# Altium project AT91SAM.PrjPcb
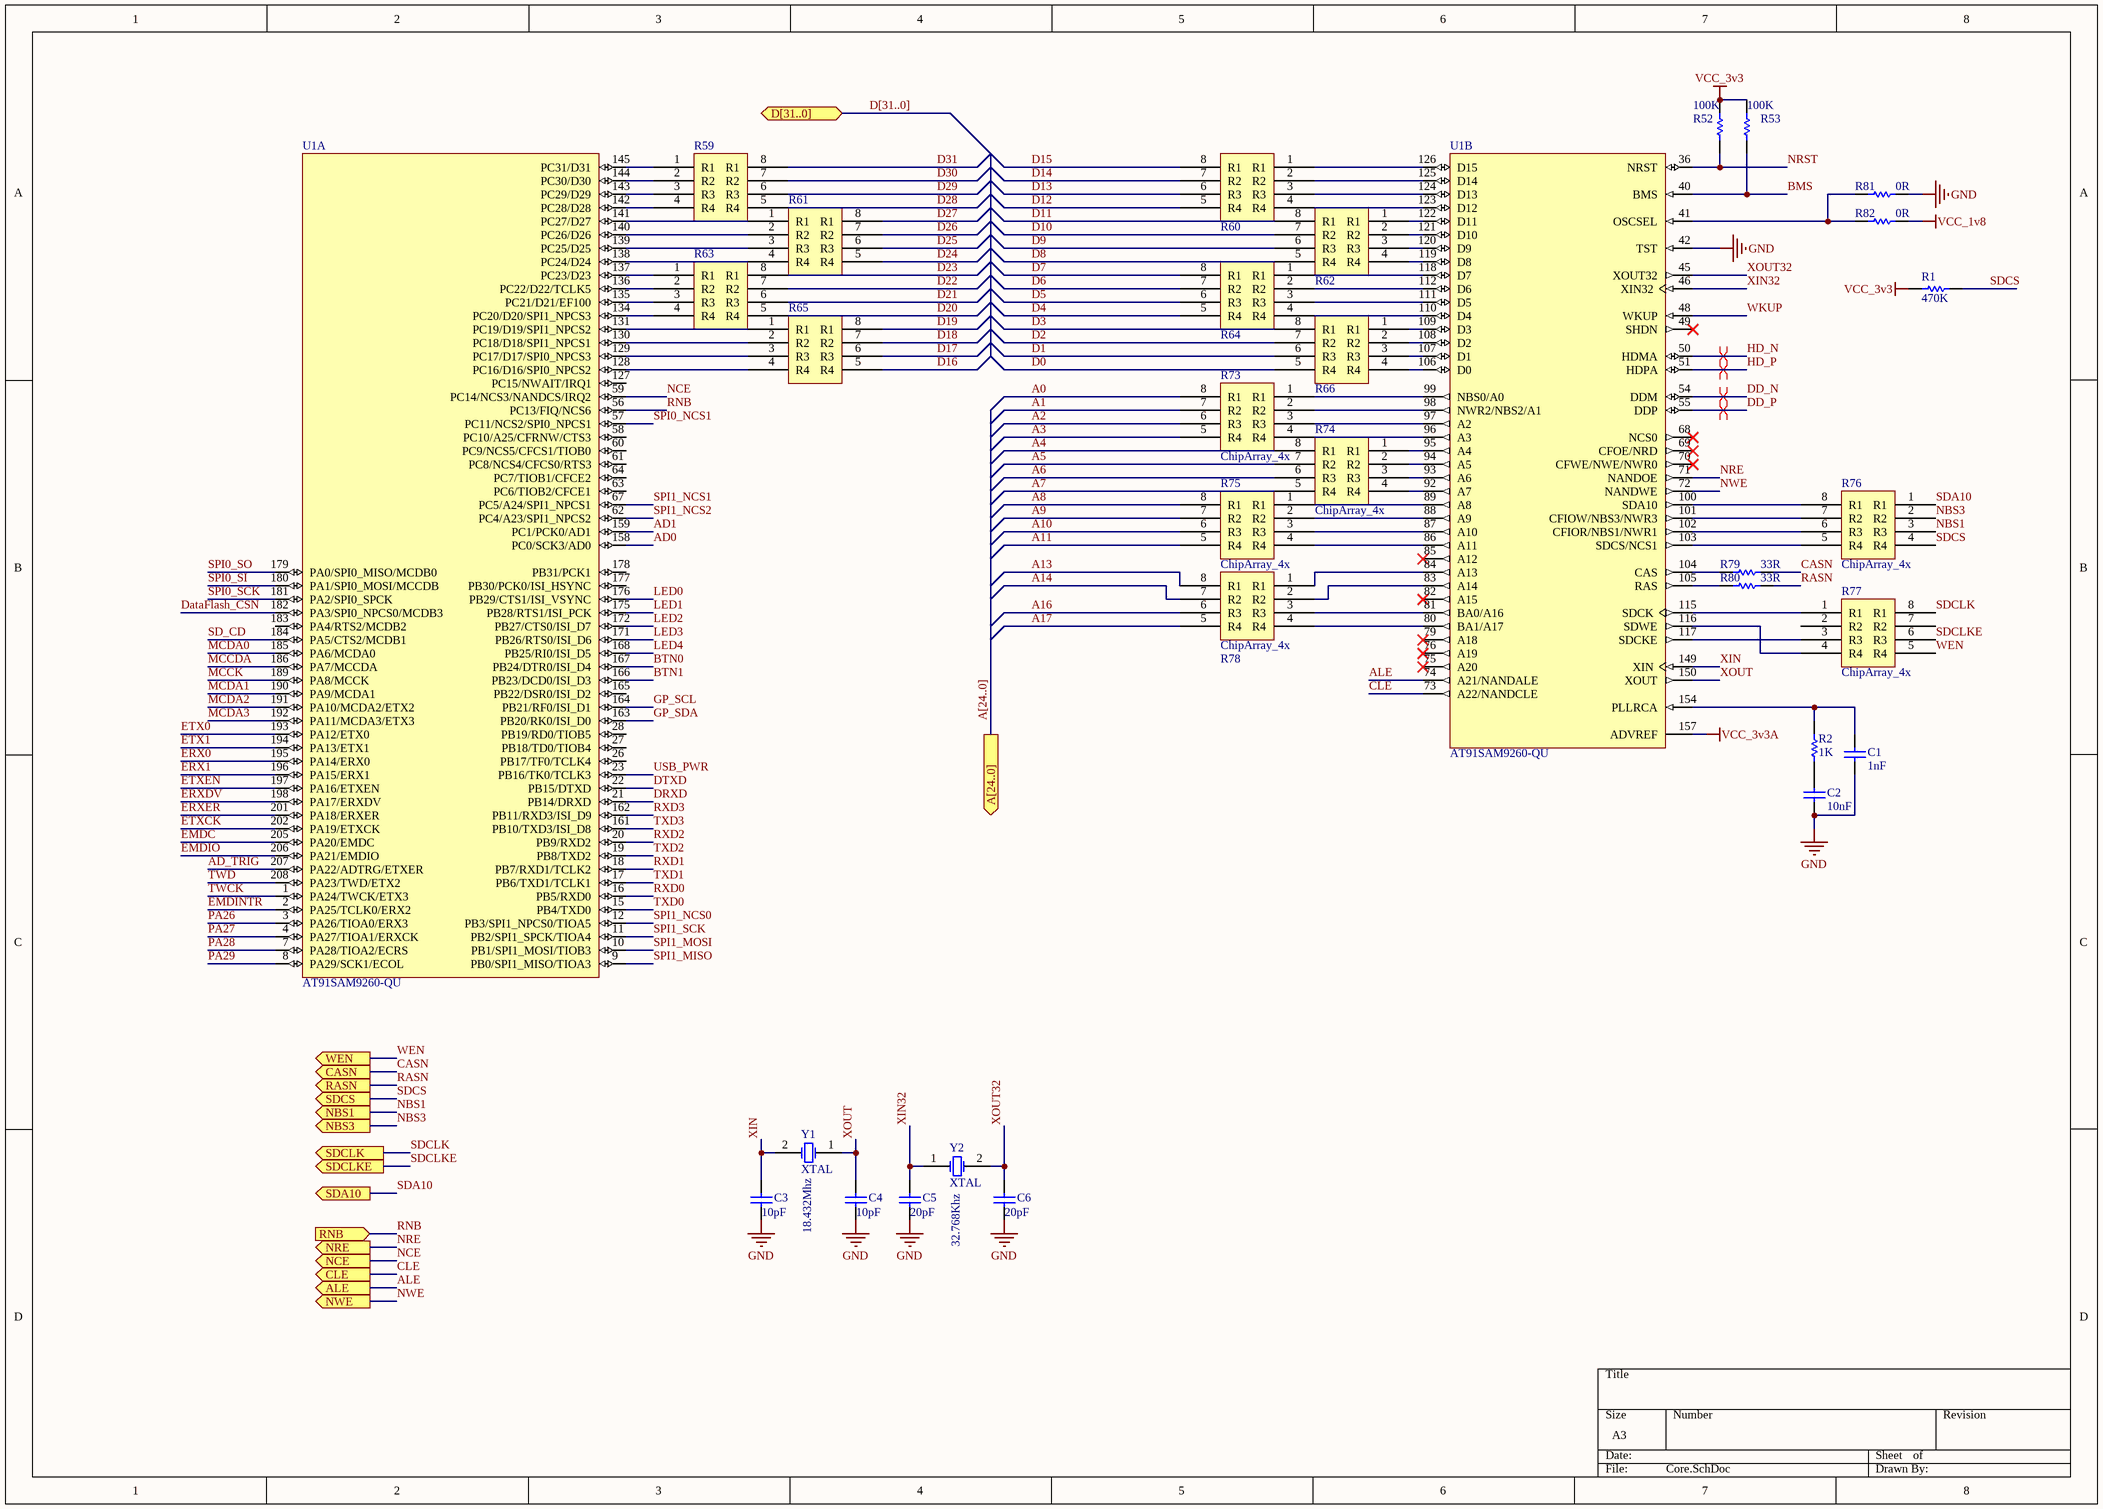
[diagram p0: Core.SchDoc]
6 sheets, 226 parts. Net scope: global (net labels, ports and power ports of the same name join across sheets).
Board file: AT91-PCB.PcbDoc
Sheets:
  Core.SchDoc
  Network.SchDoc
  Power.SchDoc
  Peripheral.SchDoc
  Memory.SchDoc
  Connector.SchDoc

## Sheet Core.SchDoc
size A3

### Parts
C1  value 1nF  [C0805]  (hidden comment: Cap)
C2  value 10nF  [C0805]  (hidden comment: Cap)
C3  value 10pF  [C0805]  (hidden comment: Cap)
C4  value 10pF  [C0805]  (hidden comment: Cap)
C5  value 20pF  [0603PKG]  (hidden comment: Cap)
C6  value 20pF  [0603PKG]  (hidden comment: Cap)
R1  value 470K  [C0805]  (hidden comment: Res Semi)
R2  value 1K  [C0805]  (hidden comment: Res Semi)
R52  value 100K  [C0805]  (hidden comment: Res1)
R53  value 100K  [C0805]  (hidden comment: Res1)
R59  ChipArray_4x  [CAC-50P205X105-8M]  (value not drawn)
R60  ChipArray_4x  [CAC-50P205X105-8M]  (value not drawn)
R61  ChipArray_4x  [CAC-50P205X105-8M]  (value not drawn)
R62  ChipArray_4x  [CAC-50P205X105-8M]  (value not drawn)
R63  ChipArray_4x  [CAC-50P205X105-8M]  (value not drawn)
R64  ChipArray_4x  [CAC-50P205X105-8M]  (value not drawn)
R65  ChipArray_4x  [CAC-50P205X105-8M]  (value not drawn)
R66  ChipArray_4x  [CAC-50P205X105-8M]  (value not drawn)
R73  ChipArray_4x  [CAC-50P205X105-8M]
R74  ChipArray_4x  [CAC-50P205X105-8M]
R75  ChipArray_4x  [CAC-50P205X105-8M]
R76  ChipArray_4x  [CAC-50P205X105-8M]
R77  ChipArray_4x  [CAC-50P205X105-8M]
R78  ChipArray_4x  [CAC-50P205X105-8M]
R79  value 33R  [C0805]  (hidden comment: Res Semi)
R80  value 33R  [C0805]  (hidden comment: Res Semi)
R81  value 0R  [0603PKG]  (hidden comment: Res Semi)
R82  value 0R  [0603PKG]  (hidden comment: Res Semi)
U1  AT91SAM9260-QU  [SQFP50P3122X3122X245-208N]  (parts A,B of 4)
Y1  XTAL  value 18.432Mhz  [SMD_Crystal]
Y2  XTAL  value 32.768Khz  [R38]

### Ports
A[24..0] (out), ALE (out), CASN (out), CLE (out), D[31..0], NBS1 (out), NBS3 (out), NCE (out), NRE (out), NWE (out), RASN (out), RNB (in), SDA10 (out), SDCLK (out), SDCLKE (out), SDCS (out), WEN (out)

### Nets
GND: C1.2 C2.1 C3.1 C4.1 C5.1 C6.1 R81.2 U1.42(TST)
VCC_1v8: R82.2
VCC_3v3: R1.1 R52.2 R53.2
VCC_3v3A: U1.157(ADVREF)
A0: R73.8(R1)
A1: R73.7(R2)
A2: R73.6(R3)
A3: R73.5(R4)
A4: R74.8(R1)
A5: R74.7(R2)
A6: R74.6(R3)
A7: R74.5(R4)
A8: R75.8(R1)
A9: R75.7(R2)
A10: R75.6(R3)
A11: R75.5(R4)
A13: R78.8(R1)
A14: R78.7(R2)
A16: R78.6(R3)
A17: R78.5(R4)
AD0: U1.158(PC0/SCK3/AD0)
AD1: U1.159(PC1/PCK0/AD1)
AD_TRIG: U1.207(PA22/ADTRG/ETXER)
ALE: U1.74(A21/NANDALE) ; port ALE
BMS: R53.1 U1.40(BMS)
BTN0: U1.167(PB24/DTR0/ISI_D4)
BTN1: U1.166(PB23/DCD0/ISI_D3)
CASN: R79.2 ; port CASN
CLE: U1.73(A22/NANDCLE) ; port CLE
D0: R66.5(R4)
D1: R66.6(R3)
D2: R66.7(R2)
D3: R66.8(R1)
D4: R64.5(R4)
D5: R64.6(R3)
D6: R64.7(R2)
D7: R64.8(R1)
D8: R62.5(R4)
D9: R62.6(R3)
D10: R62.7(R2)
D11: R62.8(R1)
D12: R60.5(R4)
D13: R60.6(R3)
D14: R60.7(R2)
D15: R60.8(R1)
D16: R65.5(R4)
D17: R65.6(R3)
D18: R65.7(R2)
D19: R65.8(R1)
D20: R63.5(R4)
D21: R63.6(R3)
D22: R63.7(R2)
D23: R63.8(R1)
D24: R61.5(R4)
D25: R61.6(R3)
D26: R61.7(R2)
D27: R61.8(R1)
D28: R59.5(R4)
D29: R59.6(R3)
D30: R59.7(R2)
D31: R59.8(R1)
DataFlash_CSN: U1.182(PA3/SPI0_NPCS0/MCDB3)
DD_N: U1.54(DDM)
DD_P: U1.55(DDP)
DRXD: U1.21(PB14/DRXD)
DTXD: U1.22(PB15/DTXD)
EMDC: U1.205(PA20/EMDC)
EMDINTR: U1.2(PA25/TCLK0/ERX2)
EMDIO: U1.206(PA21/EMDIO)
ERX0: U1.195(PA14/ERX0)
ERX1: U1.196(PA15/ERX1)
ERXDV: U1.198(PA17/ERXDV)
ERXER: U1.201(PA18/ERXER)
ETX0: U1.193(PA12/ETX0)
ETX1: U1.194(PA13/ETX1)
ETXCK: U1.202(PA19/ETXCK)
ETXEN: U1.197(PA16/ETXEN)
GP_SCL: U1.164(PB21/RF0/ISI_D1)
GP_SDA: U1.163(PB20/RK0/ISI_D0)
HD_N: U1.50(HDMA)
HD_P: U1.51(HDPA)
LED0: U1.176(PB29/CTS1/ISI_VSYNC)
LED1: U1.175(PB28/RTS1/ISI_PCK)
LED2: U1.172(PB27/CTS0/ISI_D7)
LED3: U1.171(PB26/RTS0/ISI_D6)
LED4: U1.168(PB25/RI0/ISI_D5)
MCCDA: U1.186(PA7/MCCDA)
MCCK: U1.189(PA8/MCCK)
MCDA0: U1.185(PA6/MCDA0)
MCDA1: U1.190(PA9/MCDA1)
MCDA2: U1.191(PA10/MCDA2/ETX2)
MCDA3: U1.192(PA11/MCDA3/ETX3)
NBS1: R76.3(R3) ; port NBS1
NBS3: R76.2(R2) ; port NBS3
NCE: U1.59(PC14/NCS3/NANDCS/IRQ2) ; port NCE
NRE: U1.71(NANDOE) ; port NRE
NRST: R52.1 U1.36(NRST)
NWE: U1.72(NANDWE) ; port NWE
PA26: U1.3(PA26/TIOA0/ERX3)
PA27: U1.4(PA27/TIOA1/ERXCK)
PA28: U1.7(PA28/TIOA2/ECRS)
PA29: U1.8(PA29/SCK1/ECOL)
RASN: R80.2 ; port RASN
RNB: U1.56(PC13/FIQ/NCS6) ; port RNB
RXD0: U1.16(PB5/RXD0)
RXD1: U1.18(PB7/RXD1/TCLK2)
RXD2: U1.20(PB9/RXD2)
RXD3: U1.162(PB11/RXD3/ISI_D9)
SD_CD: U1.184(PA5/CTS2/MCDB1)
SDA10: R76.1(R1) ; port SDA10
SDCLK: R77.8(R1) ; port SDCLK
SDCLKE: R77.6(R3) ; port SDCLKE
SDCS: R1.2 R76.4(R4) ; port SDCS
SPI0_NCS1: U1.57(PC11/NCS2/SPI0_NPCS1)
SPI0_SCK: U1.181(PA2/SPI0_SPCK)
SPI0_SI: U1.180(PA1/SPI0_MOSI/MCCDB)
SPI0_SO: U1.179(PA0/SPI0_MISO/MCDB0)
SPI1_MISO: U1.9(PB0/SPI1_MISO/TIOA3)
SPI1_MOSI: U1.10(PB1/SPI1_MOSI/TIOB3)
SPI1_NCS0: U1.12(PB3/SPI1_NPCS0/TIOA5)
SPI1_NCS1: U1.67(PC5/A24/SPI1_NPCS1)
SPI1_NCS2: U1.62(PC4/A23/SPI1_NPCS2)
SPI1_SCK: U1.11(PB2/SPI1_SPCK/TIOA4)
TWCK: U1.1(PA24/TWCK/ETX3)
TWD: U1.208(PA23/TWD/ETX2)
TXD0: U1.15(PB4/TXD0)
TXD1: U1.17(PB6/TXD1/TCLK1)
TXD2: U1.19(PB8/TXD2)
TXD3: U1.161(PB10/TXD3/ISI_D8)
USB_PWR: U1.23(PB16/TK0/TCLK3)
WEN: R77.5(R4) ; port WEN
WKUP: U1.48(WKUP)
XIN: C3.2 U1.149(XIN) Y1.2(OSC2)
XIN32: C5.2 U1.46(XIN32) Y2.1(OSC1)
XOUT: C4.2 U1.150(XOUT) Y1.1(OSC1)
XOUT32: C6.2 U1.45(XOUT32) Y2.2(OSC2)
NetC1_1: C1.1 R2.2 U1.154(PLLRCA)
NetC2_2: C2.2 R2.1
NetR59_1: R59.1(R1) U1.145(PC31/D31)
NetR59_2: R59.2(R2) U1.144(PC30/D30)
NetR59_3: R59.3(R3) U1.143(PC29/D29)
NetR59_4: R59.4(R4) U1.142(PC28/D28)
NetR60_1: R60.1(R1) U1.126(D15)
NetR60_2: R60.2(R2) U1.125(D14)
NetR60_3: R60.3(R3) U1.124(D13)
NetR60_4: R60.4(R4) U1.123(D12)
NetR61_1: R61.1(R1) U1.141(PC27/D27)
NetR61_2: R61.2(R2) U1.140(PC26/D26)
NetR61_3: R61.3(R3) U1.139(PC25/D25)
NetR61_4: R61.4(R4) U1.138(PC24/D24)
NetR62_1: R62.1(R1) U1.122(D11)
NetR62_2: R62.2(R2) U1.121(D10)
NetR62_3: R62.3(R3) U1.120(D9)
NetR62_4: R62.4(R4) U1.119(D8)
NetR63_1: R63.1(R1) U1.137(PC23/D23)
NetR63_2: R63.2(R2) U1.136(PC22/D22/TCLK5)
NetR63_3: R63.3(R3) U1.135(PC21/D21/EF100)
NetR63_4: R63.4(R4) U1.134(PC20/D20/SPI1_NPCS3)
NetR64_1: R64.1(R1) U1.118(D7)
NetR64_2: R64.2(R2) U1.112(D6)
NetR64_3: R64.3(R3) U1.111(D5)
NetR64_4: R64.4(R4) U1.110(D4)
NetR65_1: R65.1(R1) U1.131(PC19/D19/SPI1_NPCS2)
NetR65_2: R65.2(R2) U1.130(PC18/D18/SPI1_NPCS1)
NetR65_3: R65.3(R3) U1.129(PC17/D17/SPI0_NPCS3)
NetR65_4: R65.4(R4) U1.128(PC16/D16/SPI0_NPCS2)
NetR66_1: R66.1(R1) U1.109(D3)
NetR66_2: R66.2(R2) U1.108(D2)
NetR66_3: R66.3(R3) U1.107(D1)
NetR66_4: R66.4(R4) U1.106(D0)
NetR73_1: R73.1(R1) U1.99(NBS0/A0)
NetR73_2: R73.2(R2) U1.98(NWR2/NBS2/A1)
NetR73_3: R73.3(R3) U1.97(A2)
NetR73_4: R73.4(R4) U1.96(A3)
NetR74_1: R74.1(R1) U1.95(A4)
NetR74_2: R74.2(R2) U1.94(A5)
NetR74_3: R74.3(R3) U1.93(A6)
NetR74_4: R74.4(R4) U1.92(A7)
NetR75_1: R75.1(R1) U1.89(A8)
NetR75_2: R75.2(R2) U1.88(A9)
NetR75_3: R75.3(R3) U1.87(A10)
NetR75_4: R75.4(R4) U1.86(A11)
NetR76_5: R76.5(R4) U1.103(SDCS/NCS1)
NetR76_6: R76.6(R3) U1.102(CFIOR/NBS1/NWR1)
NetR76_7: R76.7(R2) U1.101(CFIOW/NBS3/NWR3)
NetR76_8: R76.8(R1) U1.100(SDA10)
NetR77_1: R77.1(R1) U1.115(SDCK)
NetR77_3: R77.3(R3) U1.117(SDCKE)
NetR77_4: R77.4(R4) U1.116(SDWE)
NetR78_1: R78.1(R1) U1.84(A13)
NetR78_2: R78.2(R2) U1.83(A14)
NetR78_3: R78.3(R3) U1.81(BA0/A16)
NetR78_4: R78.4(R4) U1.80(BA1/A17)
NetR79_1: R79.1 U1.104(CAS)
NetR80_1: R80.1 U1.105(RAS)
NetR81_1: R81.1 R82.1 U1.41(OSCSEL)

Not connected (* = marked no-connect by the designer): R77 2(R2) 7(R2); U1 26(PB17/TF0/TCLK4) 27(PB18/TD0/TIOB4) 28(PB19/RD0/TIOB5) 49(SHDN)* 58(PC10/A25/CFRNW/CTS3) 60(PC9/NCS5/CFCS1/TIOB0) 61(PC8/NCS4/CFCS0/RTS3) 63(PC6/TIOB2/CFCE1) 64(PC7/TIOB1/CFCE2) 68(NCS0)* 69(CFOE/NRD)* 70(CFWE/NWE/NWR0)* 75(A20)* 76(A19)* 79(A18)* 82(A15)* 85(A12)* 127(PC15/NWAIT/IRQ1) 165(PB22/DSR0/ISI_D2) 177(PB30/PCK0/ISI_HSYNC) 178(PB31/PCK1) 183(PA4/RTS2/MCDB2)

### Buses and harness runs
bus A[24..0] = port A[24..0]
bus D[31..0] = port D[31..0]

### Layout directives
differential pair: DD_N, DD_P, HD_N, HD_P

### Library data of the parts
C1-C6 = Cap: Capacitor; Published: 8-Jun-2000; LatestRevisionDate: 17-Jul-2002; LatestRevisionNote: Re-released for DXP Platform.; PackageReference: RAD-0.3; Publisher: Altium Limited; PackageDescription: Radial Cap, Thru-Hole; 2 Leads; 0.3 in Pin Spacing
R1 R2 R79-R82 = Res Semi: Semiconductor Resistor; Published: 8-Jun-2000; LatestRevisionDate: 17-Jul-2002; LatestRevisionNote: Re-released for DXP Platform.; PackageReference: AXIAL-0.5; Publisher: Altium Limited; PackageDescription: Axial Device, Thru-Hole; 2 Leads; 0.5 in Pin Spacing
R52 R53 = Res1: Resistor; Published: 8-Jun-2000; LatestRevisionDate: 17-Jul-2002; LatestRevisionNote: Re-released for DXP Platform.; PackageReference: AXIAL-0.3; Publisher: Altium Limited; PackageDescription: Axial Device, Thru-Hole; 2 Leads; 0.3 in Pin Spacing
U1 = AT91SAM9260-QU: AT91 ARM Thumb 32-bit Embedded MPU, 210MHz, 32KB ROM, 2x4KB SRAM, EBI, E-MAC, FS USB, 208-Pin PQFP, Industrial Grade (-40°C to 85°C), Pb-Free; DatasheetVersion: revJ, May-2011; PackageVersion: Jul-2005; PackageReference: QFP208; PackageDescription: 208-Pin Plastic Shrink Quad Flat Pack 0.5 mm Pitch; Code_JEDEC: MS-022; ComponentLink1Description: Manufacturer URL; ComponentLink1URL: http://www.atmel.com/; ComponentLink2Description: AT91SAM9260 Datasheet; ComponentLink2URL: http://www.atmel.com/dyn/resources/prod_documents/doc6221.pdf; ComponentLink3Description: AT91SAM9260 Summary; ComponentLink3URL: http://www.atmel.com/dyn/resources/prod_documents/6221s.pdf; ComponentLink4Description: ARM9E-S Reference Manual; ComponentLink4URL: http://www.atmel.com/dyn/resources/prod_documents/doc6178.pdf
Y1 Y2 = XTAL: Crystal Oscillator; Published: 8-Jun-2000; LatestRevisionDate: 17-Jul-2002; LatestRevisionNote: Re-released for DXP Platform.; PackageReference: R38; Publisher: Altium Limited; PackageDescription: Crystal, Thru-Hole; 2 Leads; Body 3.1 x 8.2 mm (Dia.xH)

## Sheet Network.SchDoc
size A4
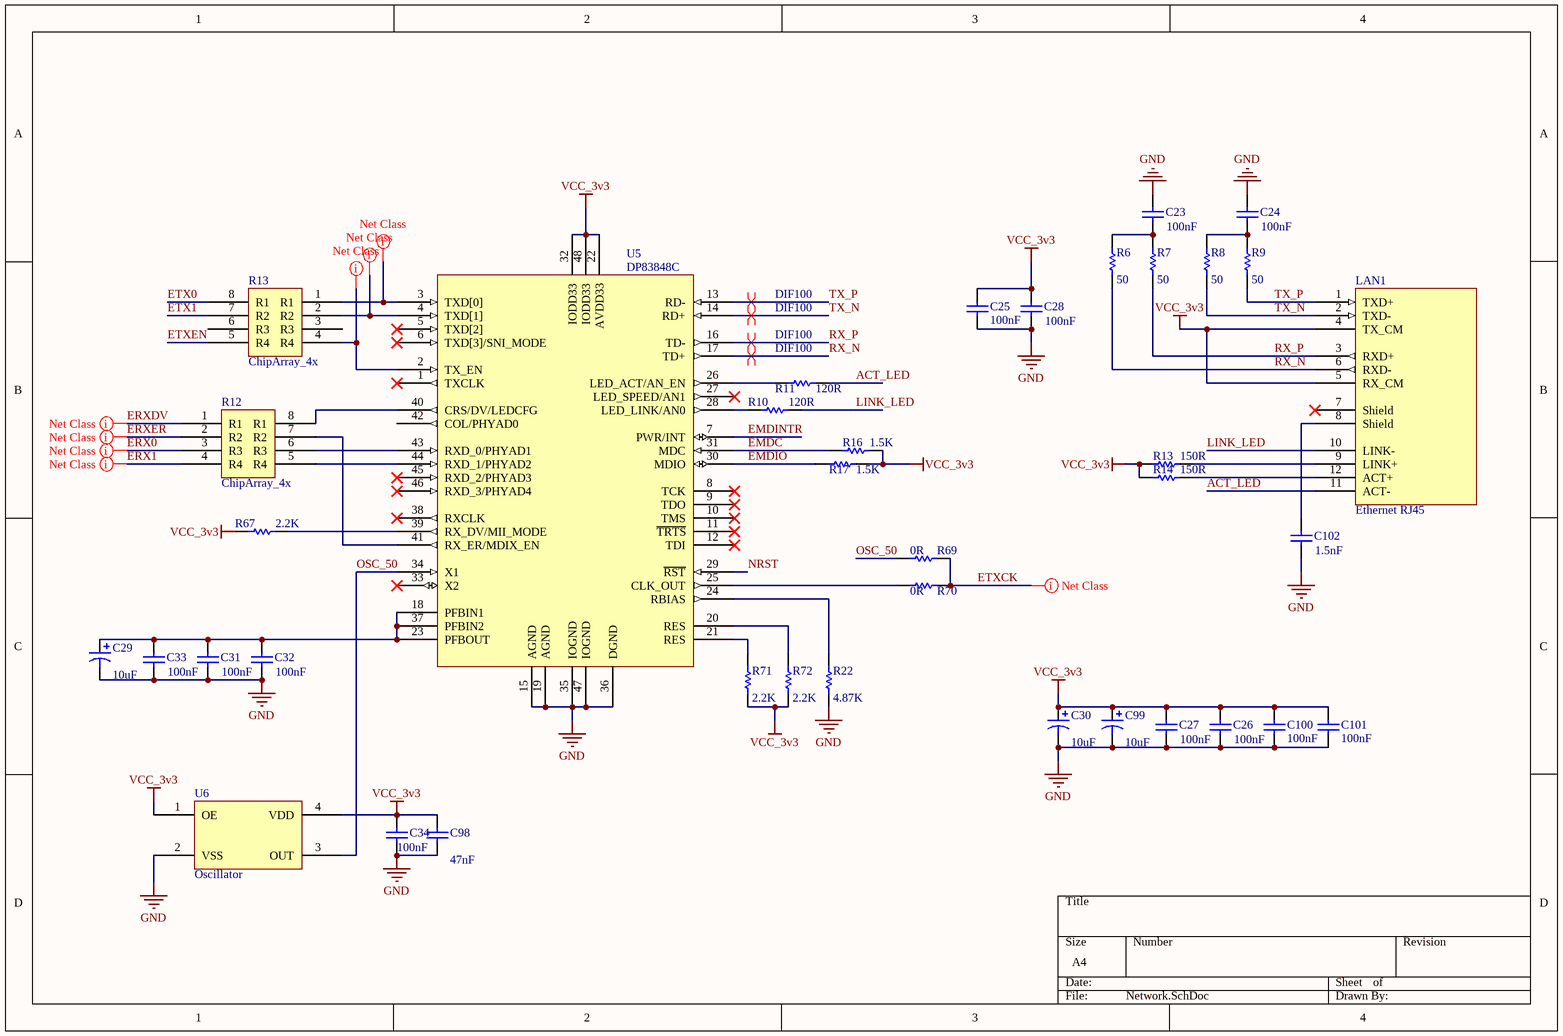
[diagram p1: Network.SchDoc]

### Parts
(Parts that share a designator on the sheet are numbered #1, #2 ... from top to bottom, then left to right.)
C23  value 100nF  [0603PKG]  (hidden comment: Cap)
C24  value 100nF  [0603PKG]  (hidden comment: Cap)
C25  value 100nF  [0603PKG]  (hidden comment: Cap)
C26  value 100nF  [0603PKG]  (hidden comment: Cap)
C27  value 100nF  [0603PKG]  (hidden comment: Cap)
C28  value 100nF  [0603PKG]  (hidden comment: Cap)
C29  value 10uF  [3216X18N]  (hidden comment: Cap Pol3)
C30  value 10uF  [3216X18N]  (hidden comment: Cap Pol3)
C31  value 100nF  [0603PKG]  (hidden comment: Cap)
C32  value 100nF  [0603PKG]  (hidden comment: Cap)
C33  value 100nF  [0603PKG]  (hidden comment: Cap)
C34  value 100nF  [0603PKG]  (hidden comment: Cap)
C98  value 47nF  [0603PKG]  (hidden comment: Cap)
C99  value 10uF  [3216X18N]  (hidden comment: Cap Pol3)
C100  value 100nF  [0603PKG]  (hidden comment: Cap)
C101  value 100nF  [0603PKG]  (hidden comment: Cap)
C102  value 1.5nF  [C0805]  (hidden comment: Cap)
LAN1  Ethernet RJ45  [RJ45]
R6  value 50  [C0805]  (hidden comment: Res Semi)
R7  value 50  [C0805]  (hidden comment: Res Semi)
R8  value 50  [C0805]  (hidden comment: Res Semi)
R9  value 50  [C0805]  (hidden comment: Res Semi)
R10  value 120R  [C0805]  (hidden comment: Res Semi)
R11  value 120R  [C0805]  (hidden comment: Res Semi)
R12  ChipArray_4x  [CAC-50P205X105-8M]
R13#1  ChipArray_4x  [CAC-50P205X105-8M]
R13#2  value 150R  [C0805]  (hidden comment: Res Semi)
R14  value 150R  [C0805]  (hidden comment: Res Semi)
R16  value 1.5K  [C0805]  (hidden comment: Res Semi)
R17  value 1.5K  [C0805]  (hidden comment: Res Semi)
R22  value 4.87K  [C0805]  (hidden comment: Res Semi)
R67  value 2.2K  [C0805]  (hidden comment: Res Semi)
R69  value 0R  [C0805]  (hidden comment: Res Semi)
R70  value 0R  [C0805]  (hidden comment: Res Semi)
R71  value 2.2K  [C0805]  (hidden comment: Res Semi)
R72  value 2.2K  [C0805]  (hidden comment: Res Semi)
U5  DP83848C  [LQFP48]
U6  Oscillator  [Crystal5x7]

### Nets
GND: C23.2 C24.2 C25.2 C26.1 C27.1 C28.1 C29.2 C30.2 C31.1 C32.1 C33.1 C34.1 C98.1 C99.2 C100.1 C101.1 C102.1 R22.1 U5.15(AGND) U5.19(AGND) U5.35(IOGND) U5.36(DGND) U5.47(IOGND) U6.2(VSS)
VCC_3v3: C25.1 C26.2 C27.2 C28.2 C30.1 C34.2 C98.2 C99.1 C100.2 C101.2 LAN1.4(TX_CM) LAN1.5(RX_CM) R13#2.1 R14.1 R16.2 R17.1 R67.2 R71.1 R72.1 U5.22(AVDD33) U5.32(IODD33) U5.48(IODD33) U6.1(OE) U6.4(VDD)
ACT_LED: LAN1.11(ACT-) R11.2
EMDC: R16.1 U5.31(MDC)
EMDINTR: U5.7(PWR/INT)
EMDIO: R17.2 U5.30(MDIO)
ERX0: R12.3(R3)
ERX1: R12.4(R4)
ERXDV: R12.1(R1)
ERXER: R12.2(R2)
ETX0: R13#1.8(R1)
ETX1: R13#1.7(R2)
ETXCK: R69.1 R70.1
ETXEN: R13#1.5(R4)
LINK_LED: LAN1.10(LINK-) R10.2
NRST: U5.29(~{RST})
OSC_50: R69.2 U5.34(X1) U6.3(OUT)
RX_N: LAN1.6(RXD-) R6.1 U5.17(TD+)
RX_P: LAN1.3(RXD+) R7.1 U5.16(TD-)
TX_N: LAN1.2(TXD-) R8.1 U5.14(RD+)
TX_P: LAN1.1(TXD+) R9.1 U5.13(RD-)
NetC23_1: C23.1 R6.2 R7.2
NetC24_1: C24.1 R8.2 R9.2
NetC29_1: C29.1 C31.2 C32.2 C33.2 U5.18(PFBIN1) U5.23(PFBOUT) U5.37(PFBIN2)
NetC102_2: C102.2 LAN1.8(Shield)
NetLAN1_9: LAN1.9(LINK+) R13#2.2
NetLAN1_12: LAN1.12(ACT+) R14.2
NetR10_1: R10.1 U5.28(LED_LINK/AN0)
NetR11_1: R11.1 U5.26(LED_ACT/AN_EN)
NetR12_5: R12.5(R4) U5.44(RXD_1/PHYAD2)
NetR12_6: R12.6(R3) U5.43(RXD_0/PHYAD1)
NetR12_7: R12.7(R2) U5.41(RX_ER/MDIX_EN)
NetR12_8: R12.8(R1) U5.40(CRS/DV/LEDCFG)
NetR13#1_1: R13#1.1(R1) U5.3(TXD[0])
NetR13#1_2: R13#1.2(R2) U5.4(TXD[1])
NetR13#1_4: R13#1.4(R4) U5.2(TX_EN)
NetR22_2: R22.2 U5.24(RBIAS)
NetR67_1: R67.1 U5.39(RX_DV/MII_MODE)
NetR70_2: R70.2 U5.25(CLK_OUT)
NetR71_2: R71.2 U5.21(RES)
NetR72_2: R72.2 U5.20(RES)

Not connected (* = marked no-connect by the designer): LAN1 7(Shield)*; R13#1 3(R3) 6(R3); U5 1(TXCLK)* 5(TXD[2])* 6(TXD[3]/SNI_MODE)* 8(TCK)* 9(TDO)* 10(TMS)* 11(~{TRTS})* 12(TDI)* 27(LED_SPEED/AN1)* 33(X2)* 38(RXCLK)* 42(COL/PHYAD0) 45(RXD_2/PHYAD3)* 46(RXD_3/PHYAD4)*

### Layout directives
differential pair; net class DIF100: RX_N, RX_P, TX_N, TX_P
net class Rx: NetR13#1_1, NetR13#1_2, NetR13#1_4
net class Tx: ERX0, ERX1, ERXDV, ERXER
net class CLK: ETXCK

### Library data of the parts
C23-C28 C31-C34 C98 C100-C102 = Cap: Capacitor; Published: 8-Jun-2000; LatestRevisionDate: 17-Jul-2002; LatestRevisionNote: Re-released for DXP Platform.; PackageReference: RAD-0.3; Publisher: Altium Limited; PackageDescription: Radial Cap, Thru-Hole; 2 Leads; 0.3 in Pin Spacing
C29 C30 C99 = Cap Pol3: Polarized Capacitor (Surface Mount); Published: 8-Jun-2000; LatestRevisionDate: 29-May-2009; LatestRevisionNote: IPC-7351 Footprint Added.; PackageReference: C0805; Publisher: Altium Limited; PackageDescription: Chip Capacitor
LAN1 = Ethernet_RJ45
R6-R11 R13#2 R14 R16 R17 R22 R67 R69-R72 = Res Semi: Semiconductor Resistor; Published: 8-Jun-2000; LatestRevisionDate: 17-Jul-2002; LatestRevisionNote: Re-released for DXP Platform.; PackageReference: AXIAL-0.5; Publisher: Altium Limited; PackageDescription: Axial Device, Thru-Hole; 2 Leads; 0.5 in Pin Spacing

## Sheet Power.SchDoc
size A
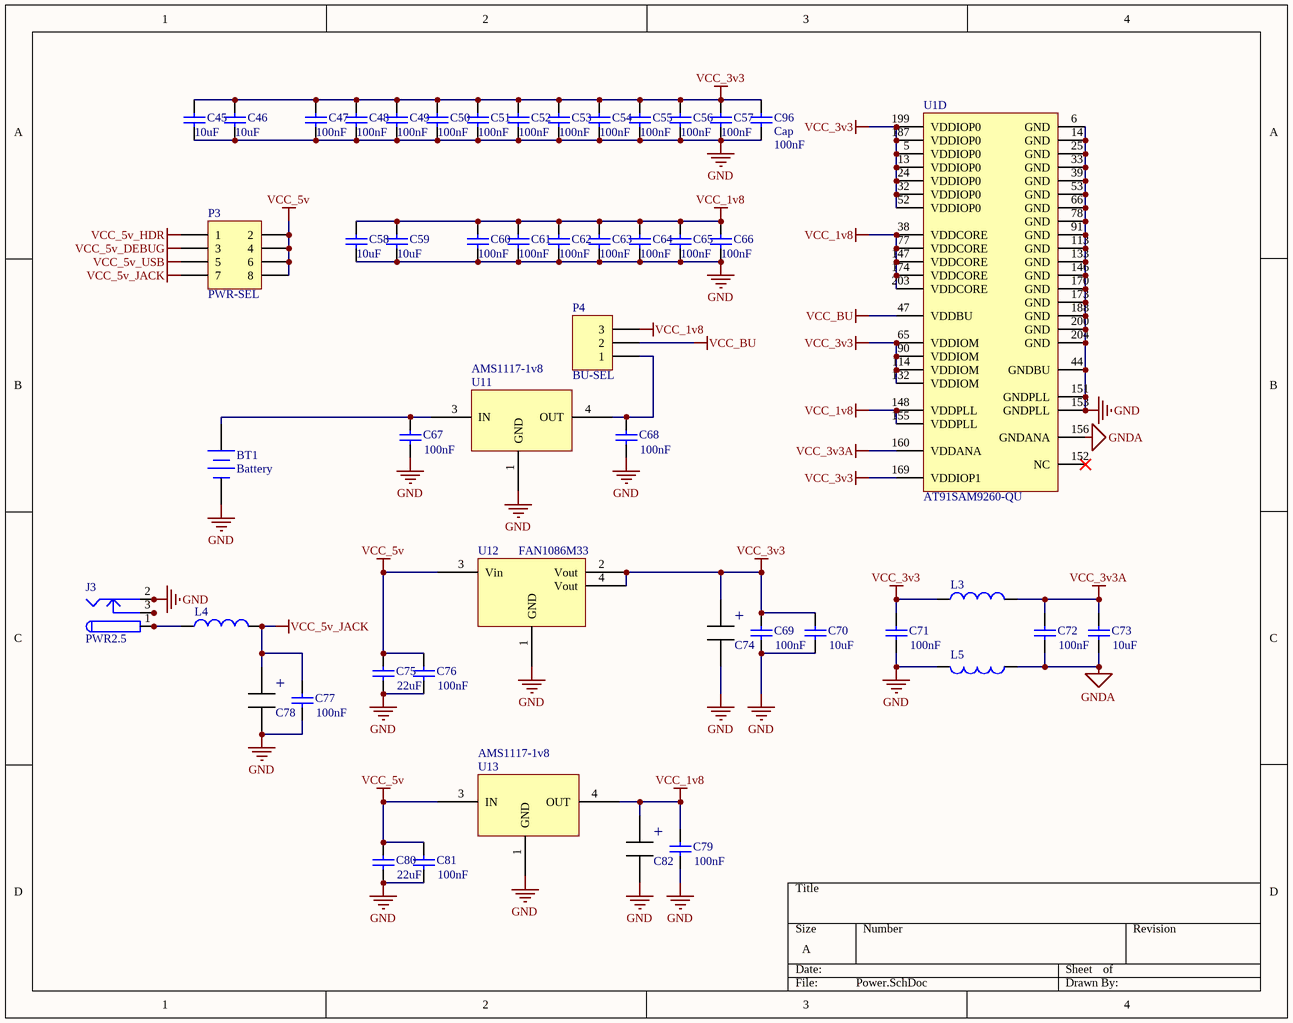
[diagram p2: Power.SchDoc]

### Parts
BT1  Battery  [BAT-2]
C45  value 10uF  [C0805]  (hidden comment: Cap)
C46  value 10uF  [C0805]  (hidden comment: Cap)
C47  value 100nF  [C0805]  (hidden comment: Cap)
C48  value 100nF  [C0805]  (hidden comment: Cap)
C49  value 100nF  [C0805]  (hidden comment: Cap)
C50  value 100nF  [C0805]  (hidden comment: Cap)
C51  value 100nF  [C0805]  (hidden comment: Cap)
C52  value 100nF  [C0805]  (hidden comment: Cap)
C53  value 100nF  [C0805]  (hidden comment: Cap)
C54  value 100nF  [C0805]  (hidden comment: Cap)
C55  value 100nF  [C0805]  (hidden comment: Cap)
C56  value 100nF  [C0805]  (hidden comment: Cap)
C57  value 100nF  [C0805]  (hidden comment: Cap)
C58  value 10uF  [C0805]  (hidden comment: Cap)
C59  value 10uF  [C0805]  (hidden comment: Cap)
C60  value 100nF  [C0805]  (hidden comment: Cap)
C61  value 100nF  [C0805]  (hidden comment: Cap)
C62  value 100nF  [C0805]  (hidden comment: Cap)
C63  value 100nF  [C0805]  (hidden comment: Cap)
C64  value 100nF  [C0805]  (hidden comment: Cap)
C65  value 100nF  [C0805]  (hidden comment: Cap)
C66  value 100nF  [C0805]  (hidden comment: Cap)
C67  value 100nF  [C0805]  (hidden comment: Cap)
C68  value 100nF  [C0805]  (hidden comment: Cap)
C69  value 100nF  [C0805]  (hidden comment: Cap)
C70  value 10uF  [C0805]  (hidden comment: Cap)
C71  value 100nF  [C0805]  (hidden comment: Cap)
C72  value 100nF  [C0805]  (hidden comment: Cap)
C73  value 10uF  [C0805]  (hidden comment: Cap)
C74  Capacitor  [Capacitor]  (value not drawn)
C75  value 22uF  [C1206]  (hidden comment: Cap)
C76  value 100nF  [C0805]  (hidden comment: Cap)
C77  value 100nF  [C1206]  (hidden comment: Cap)
C78  Capacitor  [Capacitor]  (value not drawn)
C79  value 100nF  [C0805]  (hidden comment: Cap)
C80  value 22uF  [C1206]  (hidden comment: Cap)
C81  value 100nF  [C0805]  (hidden comment: Cap)
C82  Capacitor  [Capacitor]  (value not drawn)
C96  Cap  value 100nF  [C0805]
J3  PWR2.5  [DC_jack]
L3  Ferrite Bead  [C0805]  (value not drawn)
L4  Ferrite Bead  [C1206]  (value not drawn)
L5  Inductor  [C0805]  (value not drawn)
P3  PWR-SEL  [HDR2X4]
P4  BU-SEL  [HDR1X3]
U1  AT91SAM9260-QU  [SQFP50P3122X3122X245-208N]  (part D of 4)
U11  AMS1117-1v8  [SOT223]
U12  FAN1086M33  [TO263]
U13  AMS1117-1v8  [LF33-TO-252]

### Nets
GND: BT1.2(-) C45.1 C46.1 C47.1 C48.1 C49.1 C50.1 C51.1 C52.1 C53.1 C54.1 C55.1 C56.1 C57.1 C58.1 C59.1 C60.1 C61.1 C62.1 C63.1 C64.1 C65.1 C66.1 C67.1 C68.1 C69.1 C70.1 C71.1 C74.1 C75.1 C76.1 C77.1 C78.1 C79.1 C80.1 C81.1 C82.1 C96.1 J3.2 J3.2A J3.2B L5.2 U1.6(GND) U1.14(GND) U1.25(GND) U1.33(GND) U1.39(GND) U1.44(GNDBU) U1.53(GND) U1.66(GND) U1.78(GND) U1.91(GND) U1.113(GND) U1.133(GND) U1.146(GND) U1.151(GNDPLL) U1.153(GNDPLL) U1.170(GND) U1.173(GND) U1.188(GND) U1.200(GND) U1.204(GND) U11.1(GND) U12.1(GND) U13.1(GND)
GNDA: C72.1 C73.1 L5.1 U1.156(GNDANA)
VCC_1v8: C58.2 C59.2 C60.2 C61.2 C62.2 C63.2 C64.2 C65.2 C66.2 C79.2 C82.2 P4.3 U1.38(VDDCORE) U1.77(VDDCORE) U1.147(VDDCORE) U1.148(VDDPLL) U1.155(VDDPLL) U1.174(VDDCORE) U1.203(VDDCORE) U13.4(OUT)
VCC_3v3: C45.2 C46.2 C47.2 C48.2 C49.2 C50.2 C51.2 C52.2 C53.2 C54.2 C55.2 C56.2 C57.2 C69.2 C70.2 C71.2 C74.2 C96.2 L3.1 U1.5(VDDIOP0) U1.13(VDDIOP0) U1.24(VDDIOP0) U1.32(VDDIOP0) U1.52(VDDIOP0) U1.65(VDDIOM) U1.90(VDDIOM) U1.114(VDDIOM) U1.132(VDDIOM) U1.169(VDDIOP1) U1.187(VDDIOP0) U1.199(VDDIOP0) U12.2(Vout) U12.4(Vout)
VCC_3v3A: C72.2 C73.2 L3.2 U1.160(VDDANA)
VCC_5v: C75.2 C76.2 C80.2 C81.2 P3.2 P3.4 P3.6 P3.8 U12.3(Vin) U13.3(IN)
VCC_5v_DEBUG: P3.3
VCC_5v_HDR: P3.1
VCC_5v_JACK: C77.2 C78.2 L4.2 P3.7
VCC_5v_USB: P3.5
VCC_BU: P4.2 U1.47(VDDBU)
NetBT1_1: BT1.1(+) C67.2 U11.3(IN)
NetC68_2: C68.2 P4.1 U11.4(OUT)
NetJ3_1: J3.1 J3.1A J3.1B L4.1
NetJ3_3: J3.3 J3.3A J3.3B

Not connected (* = marked no-connect by the designer): U1 152(NC)*

### Notes on the sheet
- (in symbol SMS capacitor) +

### Library data of the parts
BT1 = Battery: Multicell Battery; Published: 24-Mar-1999; LatestRevisionDate: 17-Jul-2002; LatestRevisionNote: Re-released for DXP Platform.; PackageReference: BAT-2; Publisher: Altium Limited; PackageDescription: Battery; 2 Leads
C45-C73 C75-C77 C79-C81 C96 = Cap: Capacitor; Published: 8-Jun-2000; LatestRevisionDate: 17-Jul-2002; LatestRevisionNote: Re-released for DXP Platform.; PackageReference: RAD-0.3; Publisher: Altium Limited; PackageDescription: Radial Cap, Thru-Hole; 2 Leads; 0.3 in Pin Spacing
C74 C78 C82 = SMS capacitor: Value: 47uf
J3 = PWR2.5: Low Voltage Power Supply Connector; Published: 17-Dec-2003; DatasheetDocument: 09-May-2002; Publisher: Altium Limited; ComponentLink1Description: Manufacturer Link; ComponentLink1URL: http://domino.kycon.com/internet/Products.html
L3-L5 = Inductor: Code_IEC: 1005; Value: 10mH; Published: 8-Jun-2000; LatestRevisionDate: 29-May-2009; LatestRevisionNote: IPC-7351 Footprint Added.; PackageReference: 0402-A; Publisher: Altium Limited; PackageDescription: Chip Inductor; Code_JEITA: 0402
P3 = Header 4X2: Header, 4-Pin, Dual row; LatestRevisionDate: 17-Jul-2002; LatestRevisionNote: Re-released for DXP Platform.; Publisher: Altium Limited
P4 = Header 3: Header, 3-Pin; LatestRevisionDate: 17-Jul-2002; LatestRevisionNote: Re-released for DXP Platform.; Publisher: Altium Limited
U1 = AT91SAM9260-QU: as U1 on sheet Core; DatasheetVersion: revJ, May-2011; PackageVersion: Jul-2005; PackageReference: QFP208; PackageDescription: 208-Pin Plastic Shrink Quad Flat Pack 0.5 mm Pitch; Code_JEDEC: MS-022; ComponentLink1Description: Manufacturer URL; ComponentLink1URL: http://www.atmel.com/; ComponentLink2Description: AT91SAM9260 Datasheet; ComponentLink2URL: http://www.atmel.com/dyn/resources/prod_documents/doc6221.pdf; ComponentLink3Description: AT91SAM9260 Summary; ComponentLink3URL: http://www.atmel.com/dyn/resources/prod_documents/6221s.pdf; ComponentLink4Description: ARM9E-S Reference Manual; ComponentLink4URL: http://www.atmel.com/dyn/resources/prod_documents/doc6178.pdf

## Sheet Peripheral.SchDoc
size A
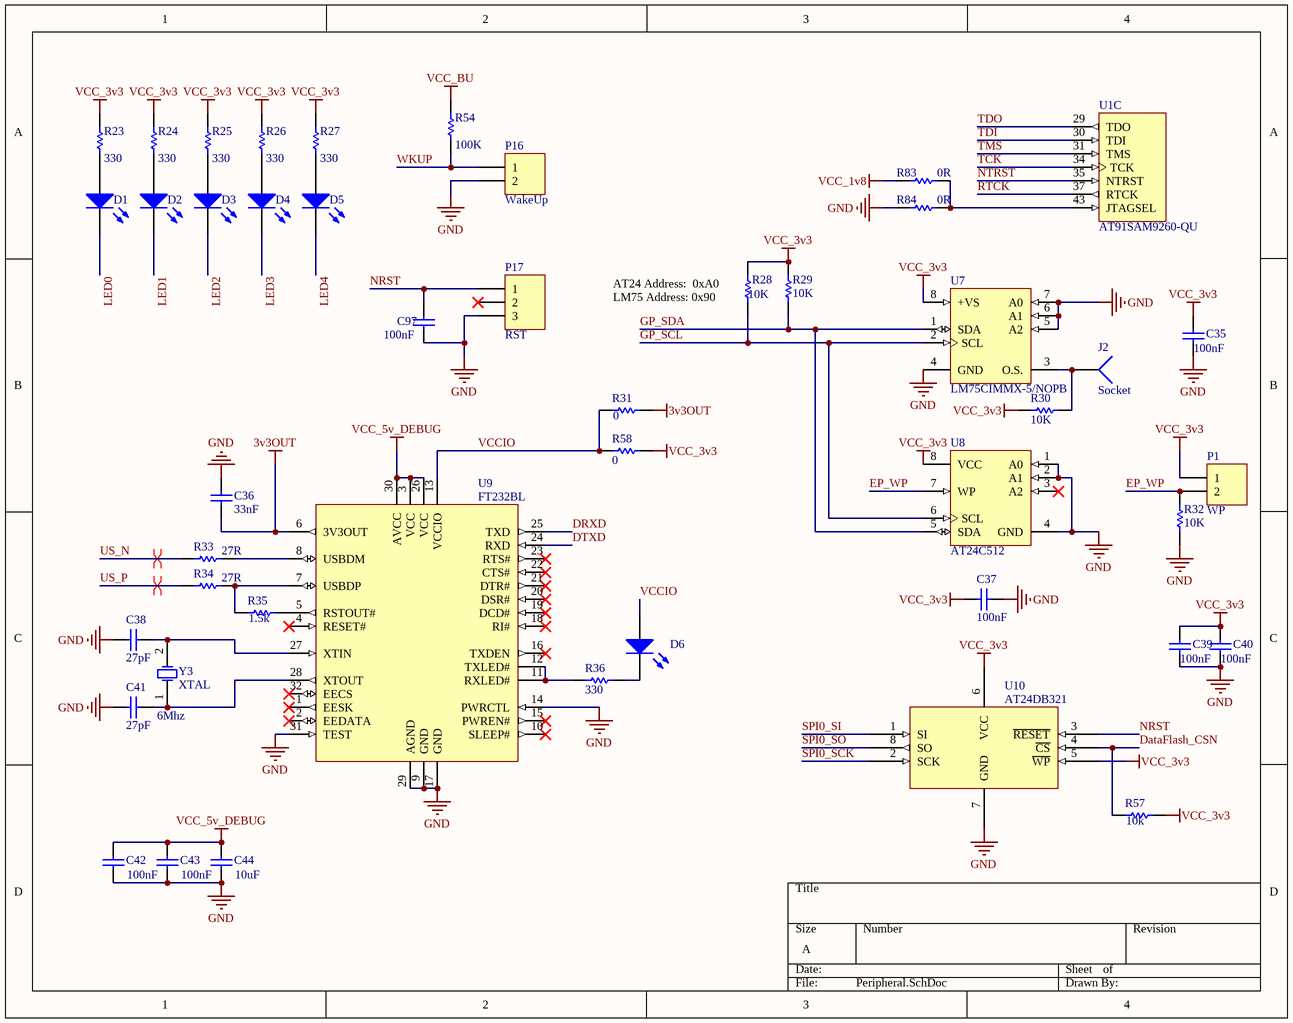
[diagram p3: Peripheral.SchDoc]

### Parts
C35  value 100nF  [C0805]  (hidden comment: Cap)
C36  value 33nF  [C0805]  (hidden comment: Cap)
C37  value 100nF  [C0805]  (hidden comment: Cap)
C38  value 27pF  [C0805]  (hidden comment: Cap)
C39  value 100nF  [C0805]  (hidden comment: Cap)
C40  value 100nF  [C0805]  (hidden comment: Cap)
C41  value 27pF  [C0805]  (hidden comment: Cap)
C42  value 100nF  [C0805]  (hidden comment: Cap)
C43  value 100nF  [C0805]  (hidden comment: Cap)
C44  value 10uF  [C0805]  (hidden comment: Cap)
C97  value 100nF  [C0805]  (hidden comment: Cap)
D1  LED0  [SMD_LED_1206]  (value not drawn)
D2  LED0  [SMD_LED_1206]  (value not drawn)
D3  LED0  [SMD_LED_1206]  (value not drawn)
D4  LED0  [SMD_LED_1206]  (value not drawn)
D5  LED0  [SMD_LED_1206]  (value not drawn)
D6  LED0  [SMD_LED_1206]  (value not drawn)
J2  Socket  [PIN1]
P1  WP  [HDR1X2]
P16  WakeUp  [HDR1X2]
P17  RST  [HDR1X3]
R23  value 330  [C0805]  (hidden comment: Res Semi)
R24  value 330  [C0805]  (hidden comment: Res Semi)
R25  value 330  [C0805]  (hidden comment: Res Semi)
R26  value 330  [C0805]  (hidden comment: Res Semi)
R27  value 330  [C0805]  (hidden comment: Res Semi)
R28  value 10K  [C0805]  (hidden comment: Res Semi)
R29  value 10K  [C0805]  (hidden comment: Res Semi)
R30  value 10K  [C0805]  (hidden comment: Res Semi)
R31  value 0  [C0805]  (hidden comment: Res Semi)
R32  value 10K  [C0805]  (hidden comment: Res Semi)
R33  value 27R  [C0805]  (hidden comment: Res Semi)
R34  value 27R  [C0805]  (hidden comment: Res Semi)
R35  value 1.5k  [C0805]  (hidden comment: Res Semi)
R36  value 330  [C0805]  (hidden comment: Res Semi)
R54  value 100K  [C0805]  (hidden comment: Res1)
R57  value 10k  [C0805]  (hidden comment: Res1)
R58  value 0  [C0805]  (hidden comment: Res Semi)
R83  value 0R  [0603PKG]  (hidden comment: Res Semi)
R84  value 0R  [0603PKG]  (hidden comment: Res Semi)
U1  AT91SAM9260-QU  [SQFP50P3122X3122X245-208N]  (part C of 4)
U7  LM75CIMMX-5/NOPB  [SSOP8]
U8  AT24C512  [SSOP8]
U9  FT232BL  [LQFP-32_N]
U10  AT24DB321  [SSOP8]
Y3  XTAL  value 6Mhz  [SMD_Crystal]

### Nets
3v3OUT: C36.2 R31.2 U9.6(3V3OUT)
GND: C35.1 C36.1 C37.1 C38.2 C39.1 C40.1 C41.2 C42.1 C43.1 C44.1 C97.1 P16.2 P17.3 R32.1 R84.2 U7.4(GND) U7.5(A2) U7.6(A1) U7.7(A0) U8.1(A0) U8.2(A1) U8.4(GND) U9.9(GND) U9.14(PWRCTL) U9.17(GND) U9.29(AGND) U9.31(TEST) U10.7(GND)
VCC_1v8: R83.2
VCC_3v3: C35.2 C37.2 C39.2 C40.2 P1.1 R23.2 R24.2 R25.2 R26.2 R27.2 R28.1 R29.1 R30.1 R57.1 R58.2 U7.8(+VS) U8.8(VCC) U10.5(~{WP}) U10.6(VCC)
VCC_5v_DEBUG: C42.2 C43.2 C44.2 U9.3(VCC) U9.26(VCC) U9.30(AVCC)
VCC_BU: R54.2
DataFlash_CSN: R57.2 U10.4(~{CS})
DRXD: U9.25(TXD)
DTXD: U9.24(RXD)
EP_WP: P1.2 R32.2 U8.7(WP)
GP_SCL: R28.2 U7.2(SCL) U8.6(SCL)
GP_SDA: R29.2 U7.1(SDA) U8.5(SDA)
LED0: D1.2(K)
LED1: D2.2(K)
LED2: D3.2(K)
LED3: D4.2(K)
LED4: D5.2(K)
NRST: C97.2 P17.1 U10.3(~{RESET})
NTRST: U1.35(NTRST)
RTCK: U1.37(RTCK)
SPI0_SCK: U10.2(SCK)
SPI0_SI: U10.1(SI)
SPI0_SO: U10.8(SO)
TCK: U1.34(TCK)
TDI: U1.30(TDI)
TDO: U1.29(TDO)
TMS: U1.31(TMS)
US_N: R33.2
US_P: R34.2
VCCIO: D6.1(A) R31.1 R58.1 U9.13(VCCIO)
WKUP: P16.1 R54.1
NetC38_1: C38.1 U9.27(XTIN) Y3.2(OSC2)
NetC41_1: C41.1 U9.28(XTOUT) Y3.1(OSC1)
NetD1_1: D1.1(A) R23.1
NetD2_1: D2.1(A) R24.1
NetD3_1: D3.1(A) R25.1
NetD4_1: D4.1(A) R26.1
NetD5_1: D5.1(A) R27.1
NetD6_2: D6.2(K) R36.1
NetJ2_1: J2.1 R30.2 U7.3(O.S.)
NetR33_1: R33.1 U9.8(USBDM)
NetR34_1: R34.1 R35.2 U9.7(USBDP)
NetR35_1: R35.1 U9.5(RSTOUT#)
NetR36_2: R36.2 U9.11(RXLED#) U9.12(TXLED#)
NetR83_1: R83.1 R84.1 U1.43(JTAGSEL)

Not connected (* = marked no-connect by the designer): P17 2*; U8 3(A2)*; U9 1(EESK)* 2(EEDATA)* 4(RESET#)* 10(SLEEP#)* 15(PWREN#)* 16(TXDEN)* 18(RI#)* 19(DCD#)* 20(DSR#)* 21(DTR#)* 22(CTS#)* 23(RTS#)* 32(EECS)*

### Layout directives
differential pair: US_N, US_P

### Notes on the sheet
- (near R28) AT24 Address:  0xA0
  LM75 Address: 0x90

### Library data of the parts
C35-C44 C97 = Cap: Capacitor; Published: 8-Jun-2000; LatestRevisionDate: 17-Jul-2002; LatestRevisionNote: Re-released for DXP Platform.; PackageReference: RAD-0.3; Publisher: Altium Limited; PackageDescription: Radial Cap, Thru-Hole; 2 Leads; 0.3 in Pin Spacing
D1-D6 = LED0: Typical INFRARED GaAs LED; Published: 8-Jun-2000; LatestRevisionDate: 08-Jul-2005; LatestRevisionNote: Mech Layer 1 removed.; PackageReference: LED-0; Publisher: Altium Limited; PackageDescription: LED; 2 Leads
P1 P16 = Header 2: Header, 2-Pin; LatestRevisionDate: 17-Jul-2002; LatestRevisionNote: Re-released for DXP Platform.; Publisher: Altium Limited
P17 = Header 3: Header, 3-Pin; LatestRevisionDate: 17-Jul-2002; LatestRevisionNote: Re-released for DXP Platform.; Publisher: Altium Limited
R23-R36 R58 R83 R84 = Res Semi: Semiconductor Resistor; Published: 8-Jun-2000; LatestRevisionDate: 17-Jul-2002; LatestRevisionNote: Re-released for DXP Platform.; PackageReference: AXIAL-0.5; Publisher: Altium Limited; PackageDescription: Axial Device, Thru-Hole; 2 Leads; 0.5 in Pin Spacing
R54 R57 = Res1: Resistor; Published: 8-Jun-2000; LatestRevisionDate: 17-Jul-2002; LatestRevisionNote: Re-released for DXP Platform.; PackageReference: AXIAL-0.3; Publisher: Altium Limited; PackageDescription: Axial Device, Thru-Hole; 2 Leads; 0.3 in Pin Spacing
U1 = AT91SAM9260-QU: as U1 on sheet Core; DatasheetVersion: revJ, May-2011; PackageVersion: Jul-2005; PackageReference: QFP208; PackageDescription: 208-Pin Plastic Shrink Quad Flat Pack 0.5 mm Pitch; Code_JEDEC: MS-022; ComponentLink1Description: Manufacturer URL; ComponentLink1URL: http://www.atmel.com/; ComponentLink2Description: AT91SAM9260 Datasheet; ComponentLink2URL: http://www.atmel.com/dyn/resources/prod_documents/doc6221.pdf; ComponentLink3Description: AT91SAM9260 Summary; ComponentLink3URL: http://www.atmel.com/dyn/resources/prod_documents/6221s.pdf; ComponentLink4Description: ARM9E-S Reference Manual; ComponentLink4URL: http://www.atmel.com/dyn/resources/prod_documents/doc6178.pdf
U7 = LM75CIMMX-5/NOPB: Digital Temperature Sensor and Thermal Watchdog with Two-Wire Interface, 8 pin MINI SOIC; Manufacturer: National Semiconductor; PackageTopMarking: ZXTT*T00C; PowerWise: N; CompType: Temp Sensor IC; High-Reliability: Y; DatasheetVersion: Jul-2009; PackageVersion: revF, Apr-2008; PackageReference: MUA08A; PackageDescription: MINI SOIC, .118 x .118 x .034in, 8 Lead, .0256in Pitch; PartNumber: LM75CIMMX-5/NOPB; RoHS: Y; PinCount: 8; Code_JEDEC: MO-187-AA; ComponentLink1Description: Manufacturer URL; ComponentLink1URL: http://www.national.com/; ComponentLink2Description: LM75C Datasheet; ComponentLink2URL: http://www.national.com/ds/LM/LM75C.pdf; ComponentLink3Description: LM75C Web Page; ComponentLink3URL: http://www.national.com/pf/LM/LM75C.html; ComponentLink4Description: MUA08A Package Page; ComponentLink4URL: http://www.national.com/packaging/folders/mua08a.html
U8 = AT24C01BN-SP25-B: 1Kbit (128 x 8), 2-wire Bus Automotive Serial EEPROM with Write Protect, 2.5V, 8-Pin SOIC, Bulk; DatasheetVersion: 8517C,  Jan-2009; PackageVersion: revC, Mar-2005; PackageReference: 8S1; PackageDescription: 8-Lead (0.150" Wide Body), Plastic Gull Wing Small Outline (JEDEC SOIC); Code_JEDEC: MS-012-AA; Code_IPC: SOIC127P600-8; ComponentLink1Description: Manufacturer URL; ComponentLink1URL: http://www.atmel.com/; ComponentLink2Description: Datasheet; ComponentLink2URL: http://www.atmel.com/dyn/resources/prod_documents/doc8517.pdf
U9 = FT232BL: USB UART Asynchronous Serial Data Transfer Chip, 0 to +70 degC, 32-pin LQFP, Pb-Free; Manufacturer: FTDI; DatasheetVersion: ver 2.2, Nov-2011; PackageVersion: Nov-11; PackageReference: LQFP-32; PackageDescription: 32-Pin Thin Quad Flat Pack, 7 x 7 mm Body, 0.8 mm Pitch; PartNumber: FT232BL; ComponentLink1Description: Manufacturer URL; ComponentLink1URL: http://www.ftdichip.com/; ComponentLink2Description: Datasheet; ComponentLink2URL: http://www.ftdichip.com/Support/Documents/DataSheets/ICs/DS_FT232BL_BQ.pdf
U10 = AT24D321: Atmel serial flash
Y3 = XTAL: Crystal Oscillator; Published: 8-Jun-2000; LatestRevisionDate: 17-Jul-2002; LatestRevisionNote: Re-released for DXP Platform.; PackageReference: R38; Publisher: Altium Limited; PackageDescription: Crystal, Thru-Hole; 2 Leads; Body 3.1 x 8.2 mm (Dia.xH)
J2 = Socket: LatestRevisionDate: 17-Jul-2002; LatestRevisionNote: Re-released for DXP Platform.; Publisher: Altium Limited

## Sheet Memory.SchDoc
size A
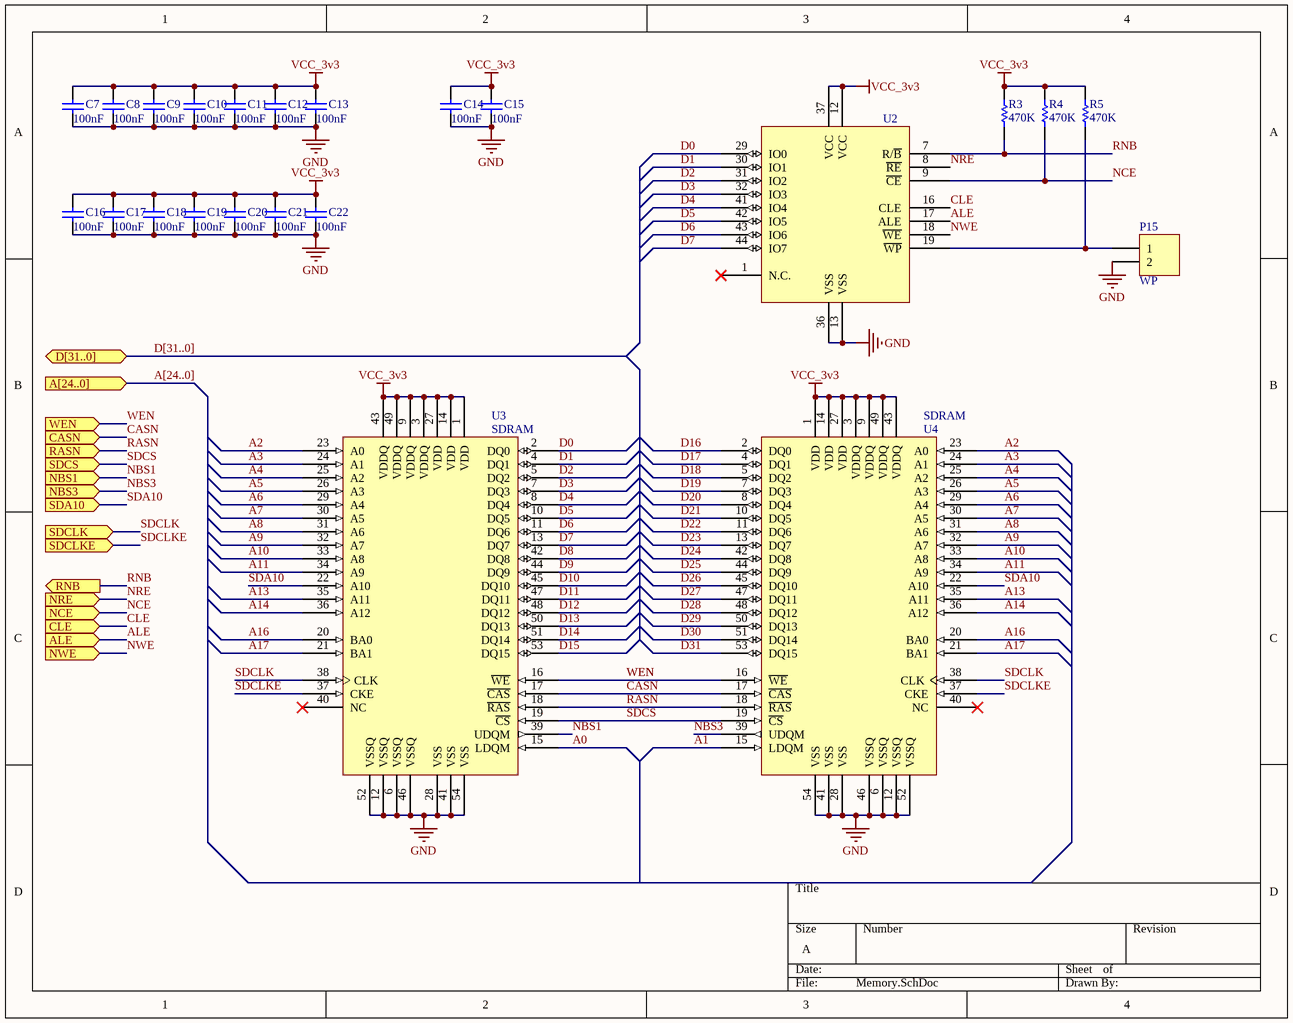
[diagram p4: Memory.SchDoc]

### Parts
C7  value 100nF  [0603PKG]  (hidden comment: Cap)
C8  value 100nF  [0603PKG]  (hidden comment: Cap)
C9  value 100nF  [0603PKG]  (hidden comment: Cap)
C10  value 100nF  [0603PKG]  (hidden comment: Cap)
C11  value 100nF  [0603PKG]  (hidden comment: Cap)
C12  value 100nF  [0603PKG]  (hidden comment: Cap)
C13  value 100nF  [0603PKG]  (hidden comment: Cap)
C14  value 100nF  [C0805]  (hidden comment: Cap)
C15  value 100nF  [C0805]  (hidden comment: Cap)
C16  value 100nF  [0603PKG]  (hidden comment: Cap)
C17  value 100nF  [0603PKG]  (hidden comment: Cap)
C18  value 100nF  [0603PKG]  (hidden comment: Cap)
C19  value 100nF  [0603PKG]  (hidden comment: Cap)
C20  value 100nF  [0603PKG]  (hidden comment: Cap)
C21  value 100nF  [0603PKG]  (hidden comment: Cap)
C22  value 100nF  [0603PKG]  (hidden comment: Cap)
P15  WP  [HDR1X2]
R3  value 470K  [C0805]  (hidden comment: Res Semi)
R4  value 470K  [C0805]  (hidden comment: Res Semi)
R5  value 470K  [C0805]  (hidden comment: Res Semi)
U2  NAND FLASH  [TSSOP-48]  (value not drawn)
U3  SDRAM  [TSOP54_Pin]
U4  SDRAM  [TSOP54_Pin]

### Ports
A[24..0] (in), ALE (in), CASN (in), CLE (in), D[31..0], NBS1 (in), NBS3 (in), NCE (in), NRE (in), NWE (in), RASN (in), RNB (out), SDA10 (in), SDCLK (in), SDCLKE (in), SDCS (in), WEN (in)

### Nets
GND: C7.1 C8.1 C9.1 C10.1 C11.1 C12.1 C13.1 C14.1 C15.1 C16.1 C17.1 C18.1 C19.1 C20.1 C21.1 C22.1 P15.2 U2.13(VSS) U2.36(VSS) U3.6(VSSQ) U3.12(VSSQ) U3.28(VSS) U3.41(VSS) U3.46(VSSQ) U3.52(VSSQ) U3.54(VSS) U4.6(VSSQ) U4.12(VSSQ) U4.28(VSS) U4.41(VSS) U4.46(VSSQ) U4.52(VSSQ) U4.54(VSS)
VCC_3v3: C7.2 C8.2 C9.2 C10.2 C11.2 C12.2 C13.2 C14.2 C15.2 C16.2 C17.2 C18.2 C19.2 C20.2 C21.2 C22.2 R3.1 R4.1 R5.1 U2.12(VCC) U2.37(VCC) U3.1(VDD) U3.3(VDDQ) U3.9(VDDQ) U3.14(VDD) U3.27(VDD) U3.43(VDDQ) U3.49(VDDQ) U4.1(VDD) U4.3(VDDQ) U4.9(VDDQ) U4.14(VDD) U4.27(VDD) U4.43(VDDQ) U4.49(VDDQ)
A0: U3.15(LDQM)
A1: U4.15(LDQM)
A2: U3.23(A0) U4.23(A0)
A3: U3.24(A1) U4.24(A1)
A4: U3.25(A2) U4.25(A2)
A5: U3.26(A3) U4.26(A3)
A6: U3.29(A4) U4.29(A4)
A7: U3.30(A5) U4.30(A5)
A8: U3.31(A6) U4.31(A6)
A9: U3.32(A7) U4.32(A7)
A10: U3.33(A8) U4.33(A8)
A11: U3.34(A9) U4.34(A9)
A13: U3.35(A11) U4.35(A11)
A14: U3.36(A12) U4.36(A12)
A16: U3.20(BA0) U4.20(BA0)
A17: U3.21(BA1) U4.21(BA1)
ALE: U2.17(ALE) ; port ALE
CASN: U3.17(~{CAS}) U4.17(~{CAS}) ; port CASN
CLE: U2.16(CLE) ; port CLE
D0: U2.29(IO0) U3.2(DQ0)
D1: U2.30(IO1) U3.4(DQ1)
D2: U2.31(IO2) U3.5(DQ2)
D3: U2.32(IO3) U3.7(DQ3)
D4: U2.41(IO4) U3.8(DQ4)
D5: U2.42(IO5) U3.10(DQ5)
D6: U2.43(IO6) U3.11(DQ6)
D7: U2.44(IO7) U3.13(DQ7)
D8: U3.42(DQ8)
D9: U3.44(DQ9)
D10: U3.45(DQ10)
D11: U3.47(DQ11)
D12: U3.48(DQ12)
D13: U3.50(DQ13)
D14: U3.51(DQ14)
D15: U3.53(DQ15)
D16: U4.2(DQ0)
D17: U4.4(DQ1)
D18: U4.5(DQ2)
D19: U4.7(DQ3)
D20: U4.8(DQ4)
D21: U4.10(DQ5)
D22: U4.11(DQ6)
D23: U4.13(DQ7)
D24: U4.42(DQ8)
D25: U4.44(DQ9)
D26: U4.45(DQ10)
D27: U4.47(DQ11)
D28: U4.48(DQ12)
D29: U4.50(DQ13)
D30: U4.51(DQ14)
D31: U4.53(DQ15)
NBS1: U3.39(UDQM) ; port NBS1
NBS3: U4.39(UDQM) ; port NBS3
NCE: R4.2 U2.9(~{CE}) ; port NCE
NRE: U2.8(~{RE}) ; port NRE
NWE: U2.18(~{WE}) ; port NWE
RASN: U3.18(~{RAS}) U4.18(~{RAS}) ; port RASN
RNB: R3.2 U2.7(R/~{B}) ; port RNB
SDA10: U3.22(A10) U4.22(A10) ; port SDA10
SDCLK: U3.38(CLK) U4.38(CLK) ; port SDCLK
SDCLKE: U3.37(CKE) U4.37(CKE) ; port SDCLKE
SDCS: U3.19(~{CS}) U4.19(~{CS}) ; port SDCS
WEN: U3.16(~{WE}) U4.16(~{WE}) ; port WEN
NetP15_1: P15.1 R5.2 U2.19(~{WP})

Not connected (* = marked no-connect by the designer): U2 1(N.C.)*; U3 40(NC)*; U4 40(NC)*

### Buses and harness runs
bus A[24..0] = port A[24..0]
bus D[31..0] = port D[31..0]

### Library data of the parts
C7-C22 = Cap: Capacitor; Published: 8-Jun-2000; LatestRevisionDate: 17-Jul-2002; LatestRevisionNote: Re-released for DXP Platform.; PackageReference: RAD-0.3; Publisher: Altium Limited; PackageDescription: Radial Cap, Thru-Hole; 2 Leads; 0.3 in Pin Spacing
P15 = Header 2: Header, 2-Pin; LatestRevisionDate: 17-Jul-2002; LatestRevisionNote: Re-released for DXP Platform.; Publisher: Altium Limited
R3-R5 = Res Semi: Semiconductor Resistor; Published: 8-Jun-2000; LatestRevisionDate: 17-Jul-2002; LatestRevisionNote: Re-released for DXP Platform.; PackageReference: AXIAL-0.5; Publisher: Altium Limited; PackageDescription: Axial Device, Thru-Hole; 2 Leads; 0.5 in Pin Spacing
U2 = K9F2G08U0A
U3 U4 = K4S561632C

## Sheet Connector.SchDoc
size A
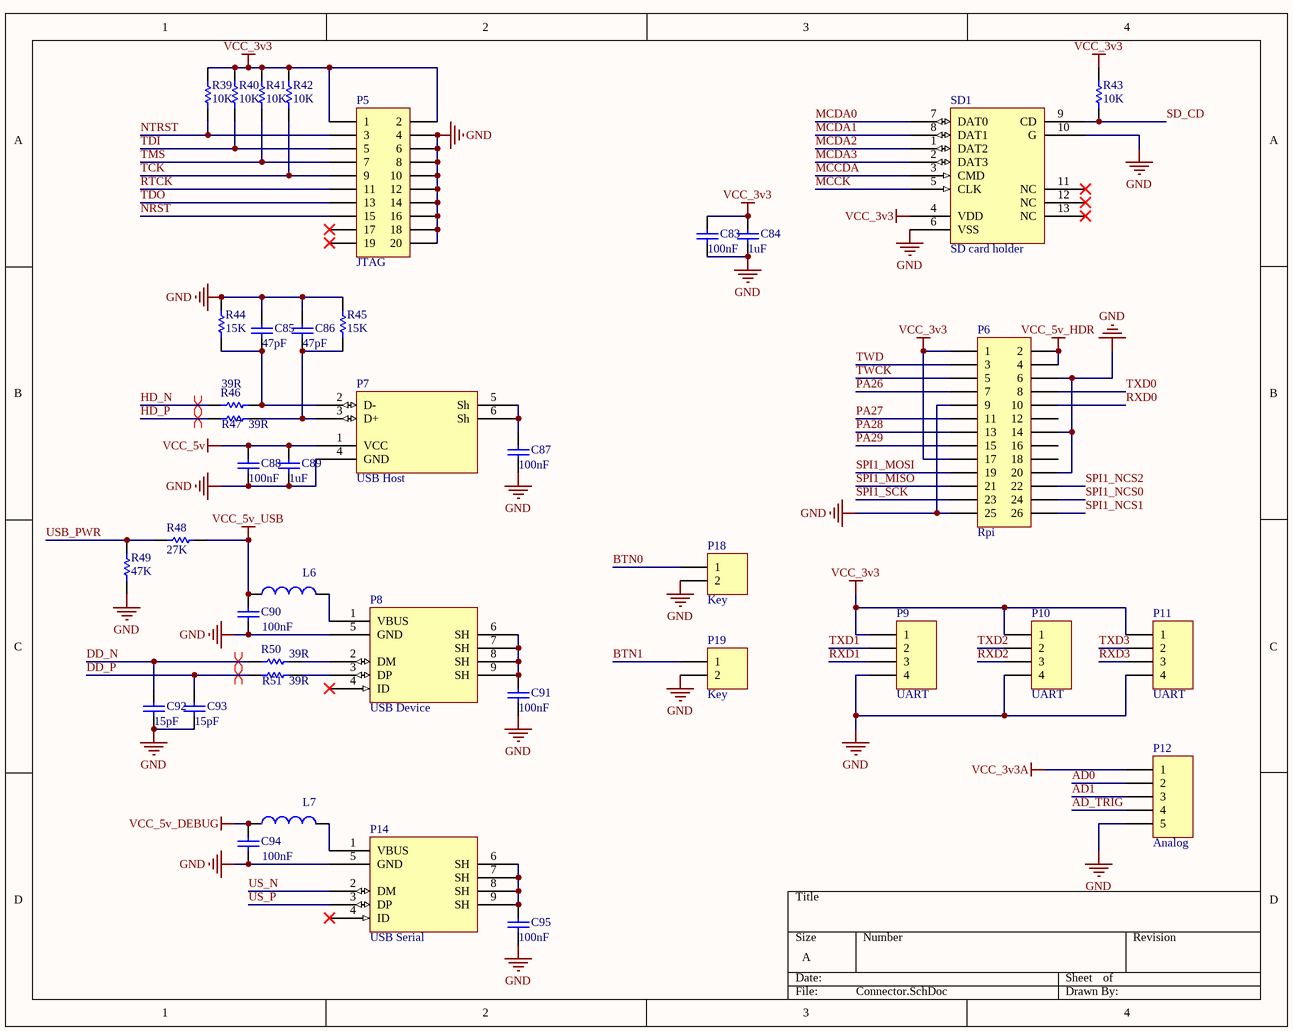
[diagram p5: Connector.SchDoc]

### Parts
C83  value 100nF  [C0805]  (hidden comment: Cap)
C84  value 1uF  [C0805]  (hidden comment: Cap)
C85  value 47pF  [C0805]  (hidden comment: Cap)
C86  value 47pF  [C0805]  (hidden comment: Cap)
C87  value 100nF  [C0805]  (hidden comment: Cap)
C88  value 100nF  [C0805]  (hidden comment: Cap)
C89  value 1uF  [C0805]  (hidden comment: Cap)
C90  value 100nF  [C0805]  (hidden comment: Cap)
C91  value 100nF  [C0805]  (hidden comment: Cap)
C92  value 15pF  [C0805]  (hidden comment: Cap)
C93  value 15pF  [C0805]  (hidden comment: Cap)
C94  value 100nF  [C0805]  (hidden comment: Cap)
C95  value 100nF  [C0805]  (hidden comment: Cap)
L6  Ferrite Bead  [C0805]  (value not drawn)
L7  Ferrite Bead  [C0805]  (value not drawn)
P5  JTAG  [IDC_2X10]
P6  Rpi  [HDR2X13]
P7  USB Host  [USB_Female]
P8  USB Device  [Mini USB]
P9  UART  [XH_4pin]
P10  UART  [XH_4pin]
P11  UART  [XH_4pin]
P12  Analog  [XH_5pin]
P14  USB Serial  [Mini USB]
P18  Key  [HDR1X2]
P19  Key  [HDR1X2]
R39  value 10K  [C0805]  (hidden comment: Res Semi)
R40  value 10K  [C0805]  (hidden comment: Res Semi)
R41  value 10K  [C0805]  (hidden comment: Res Semi)
R42  value 10K  [C0805]  (hidden comment: Res Semi)
R43  value 10K  [C0805]  (hidden comment: Res Semi)
R44  value 15K  [C0805]  (hidden comment: Res Semi)
R45  value 15K  [C0805]  (hidden comment: Res Semi)
R46  value 39R  [C0805]  (hidden comment: Res Semi)
R47  value 39R  [C0805]  (hidden comment: Res Semi)
R48  value 27K  [C0805]  (hidden comment: Res Semi)
R49  value 47K  [C0805]  (hidden comment: Res Semi)
R50  value 39R  [C0805]  (hidden comment: Res Semi)
R51  value 39R  [C0805]  (hidden comment: Res Semi)
SD1  SD card holder  [MicroSD socket]

### Nets
GND: C83.1 C84.1 C85.2 C86.2 C87.1 C88.1 C89.1 C90.1 C91.1 C92.1 C93.1 C94.1 C95.1 P5.4 P5.6 P5.8 P5.10 P5.12 P5.14 P5.16 P5.18 P5.20 P6.6 P6.9 P6.14 P6.20 P6.25 P7.4(GND) P8.5(GND) P9.4 P10.4 P11.4 P12.5 P14.5(GND) P18.2 P19.2 R44.1 R45.1 R49.2 SD1.6(VSS) SD1.10(G)
VCC_3v3: C83.2 C84.2 P5.1 P5.2 P6.1 P6.17 P9.1 P10.1 P11.1 R39.1 R40.1 R41.1 R42.1 R43.1 SD1.4(VDD)
VCC_3v3A: P12.1
VCC_5v: C88.2 C89.2 P7.1(VCC)
VCC_5v_DEBUG: C94.2 L7.1
VCC_5v_HDR: P6.2 P6.4
VCC_5v_USB: C90.2 L6.1 R48.1
AD0: P12.2
AD1: P12.3
AD_TRIG: P12.4
BTN0: P18.1
BTN1: P19.1
DD_N: C92.2 R50.1
DD_P: C93.2 R51.1
HD_N: R46.1
HD_P: R47.1
MCCDA: SD1.3(CMD)
MCCK: SD1.5(CLK)
MCDA0: SD1.7(DAT0)
MCDA1: SD1.8(DAT1)
MCDA2: SD1.1(DAT2)
MCDA3: SD1.2(DAT3)
NRST: P5.15
NTRST: P5.3 R39.2
PA26: P6.7
PA27: P6.11
PA28: P6.13
PA29: P6.15
RTCK: P5.11
RXD0: P6.10
RXD1: P9.3
RXD2: P10.3
RXD3: P11.3
SD_CD: R43.2 SD1.9(CD)
SPI1_MISO: P6.21
SPI1_MOSI: P6.19
SPI1_NCS0: P6.24
SPI1_NCS1: P6.26
SPI1_NCS2: P6.22
SPI1_SCK: P6.23
TCK: P5.9 R42.2
TDI: P5.5 R40.2
TDO: P5.13
TMS: P5.7 R41.2
TWCK: P6.5
TWD: P6.3
TXD0: P6.8
TXD1: P9.2
TXD2: P10.2
TXD3: P11.2
US_N: P14.2(DM)
US_P: P14.3(DP)
USB_PWR: R48.2 R49.1
NetC85_1: C85.1 P7.2(D-) R44.2 R46.2
NetC86_1: C86.1 P7.3(D+) R45.2 R47.2
NetC87_2: C87.2 P7.5(Sh) P7.6(Sh)
NetC91_2: C91.2 P8.6(SH) P8.7(SH) P8.8(SH) P8.9(SH)
NetC95_2: C95.2 P14.6(SH) P14.7(SH) P14.8(SH) P14.9(SH)
NetL6_2: L6.2 P8.1(VBUS)
NetL7_2: L7.2 P14.1(VBUS)
NetP8_2: P8.2(DM) R50.2
NetP8_3: P8.3(DP) R51.2

Not connected (* = marked no-connect by the designer): P5 17* 19*; P6 12 16 18; P8 4(ID)*; P14 4(ID)*; SD1 11(NC)* 12(NC)* 13(NC)*

### Layout directives
differential pair: DD_N, DD_P, HD_N, HD_P

### Library data of the parts
C83-C95 = Cap: Capacitor; Published: 8-Jun-2000; LatestRevisionDate: 17-Jul-2002; LatestRevisionNote: Re-released for DXP Platform.; PackageReference: RAD-0.3; Publisher: Altium Limited; PackageDescription: Radial Cap, Thru-Hole; 2 Leads; 0.3 in Pin Spacing
L6 L7 = Inductor: Code_IEC: 1005; Value: 10mH; Published: 8-Jun-2000; LatestRevisionDate: 29-May-2009; LatestRevisionNote: IPC-7351 Footprint Added.; PackageReference: 0402-A; Publisher: Altium Limited; PackageDescription: Chip Inductor; Code_JEITA: 0402
P5 = Header 10X2: Header, 10-Pin, Dual row; LatestRevisionDate: 17-Jul-2002; LatestRevisionNote: Re-released for DXP Platform.; Publisher: Altium Limited
P6 = Header 13X2: Header, 13-Pin, Dual row; LatestRevisionDate: 17-Jul-2002; LatestRevisionNote: Re-released for DXP Platform.; Publisher: Altium Limited
P8 P14 = Mini USB
P9-P11 = Header 4: Header, 4-Pin; LatestRevisionDate: 17-Jul-2002; LatestRevisionNote: Re-released for DXP Platform.; Publisher: Altium Limited
P12 = Header 5: Header, 5-Pin; LatestRevisionDate: 17-Jul-2002; LatestRevisionNote: Re-released for DXP Platform.; Publisher: Altium Limited
P18 P19 = Header 2: Header, 2-Pin; LatestRevisionDate: 17-Jul-2002; LatestRevisionNote: Re-released for DXP Platform.; Publisher: Altium Limited
R39-R51 = Res Semi: Semiconductor Resistor; Published: 8-Jun-2000; LatestRevisionDate: 17-Jul-2002; LatestRevisionNote: Re-released for DXP Platform.; PackageReference: AXIAL-0.5; Publisher: Altium Limited; PackageDescription: Axial Device, Thru-Hole; 2 Leads; 0.5 in Pin Spacing
SD1 = MicroSD_holder

## Nets that join several sheets
GND: Core (8 pins), Network (24 pins), Power (65 pins), Peripheral (28 pins), Memory (33 pins), Connector (41 pins)
VCC_1v8: Core (R82.2), Power (20 pins), Peripheral (R83.2)
VCC_3v3: Core (R1.1 R52.2 R53.2), Network (24 pins), Power (33 pins), Peripheral (19 pins), Memory (35 pins), Connector (15 pins)
VCC_3v3A: Core (U1.157), Power (C72.2 C73.2 L3.2 U1.160), Connector (P12.1)
VCC_5v: Power (10 pins), Connector (C88.2 C89.2 P7.1)
VCC_5v_DEBUG: Power (P3.3), Peripheral (6 pins), Connector (C94.2 L7.1)
VCC_5v_HDR: Power (P3.1), Connector (P6.2 P6.4)
VCC_5v_USB: Power (P3.5), Connector (C90.2 L6.1 R48.1)
VCC_BU: Power (P4.2 U1.47), Peripheral (R54.2)
A0: Core (R73.8), Memory (U3.15)
A1: Core (R73.7), Memory (U4.15)
A2: Core (R73.6), Memory (U3.23 U4.23)
A3: Core (R73.5), Memory (U3.24 U4.24)
A4: Core (R74.8), Memory (U3.25 U4.25)
A5: Core (R74.7), Memory (U3.26 U4.26)
A6: Core (R74.6), Memory (U3.29 U4.29)
A7: Core (R74.5), Memory (U3.30 U4.30)
A8: Core (R75.8), Memory (U3.31 U4.31)
A9: Core (R75.7), Memory (U3.32 U4.32)
A10: Core (R75.6), Memory (U3.33 U4.33)
A11: Core (R75.5), Memory (U3.34 U4.34)
A13: Core (R78.8), Memory (U3.35 U4.35)
A14: Core (R78.7), Memory (U3.36 U4.36)
A16: Core (R78.6), Memory (U3.20 U4.20)
A17: Core (R78.5), Memory (U3.21 U4.21)
AD0: Core (U1.158), Connector (P12.2)
AD1: Core (U1.159), Connector (P12.3)
AD_TRIG: Core (U1.207), Connector (P12.4)
ALE: Core (U1.74), Memory (U2.17)
BTN0: Core (U1.167), Connector (P18.1)
BTN1: Core (U1.166), Connector (P19.1)
CASN: Core (R79.2), Memory (U3.17 U4.17)
CLE: Core (U1.73), Memory (U2.16)
D0: Core (R66.5), Memory (U2.29 U3.2)
D1: Core (R66.6), Memory (U2.30 U3.4)
D2: Core (R66.7), Memory (U2.31 U3.5)
D3: Core (R66.8), Memory (U2.32 U3.7)
D4: Core (R64.5), Memory (U2.41 U3.8)
D5: Core (R64.6), Memory (U2.42 U3.10)
D6: Core (R64.7), Memory (U2.43 U3.11)
D7: Core (R64.8), Memory (U2.44 U3.13)
D8: Core (R62.5), Memory (U3.42)
D9: Core (R62.6), Memory (U3.44)
D10: Core (R62.7), Memory (U3.45)
D11: Core (R62.8), Memory (U3.47)
D12: Core (R60.5), Memory (U3.48)
D13: Core (R60.6), Memory (U3.50)
D14: Core (R60.7), Memory (U3.51)
D15: Core (R60.8), Memory (U3.53)
D16: Core (R65.5), Memory (U4.2)
D17: Core (R65.6), Memory (U4.4)
D18: Core (R65.7), Memory (U4.5)
D19: Core (R65.8), Memory (U4.7)
D20: Core (R63.5), Memory (U4.8)
D21: Core (R63.6), Memory (U4.10)
D22: Core (R63.7), Memory (U4.11)
D23: Core (R63.8), Memory (U4.13)
D24: Core (R61.5), Memory (U4.42)
D25: Core (R61.6), Memory (U4.44)
D26: Core (R61.7), Memory (U4.45)
D27: Core (R61.8), Memory (U4.47)
D28: Core (R59.5), Memory (U4.48)
D29: Core (R59.6), Memory (U4.50)
D30: Core (R59.7), Memory (U4.51)
D31: Core (R59.8), Memory (U4.53)
DataFlash_CSN: Core (U1.182), Peripheral (R57.2 U10.4)
DD_N: Core (U1.54), Connector (C92.2 R50.1)
DD_P: Core (U1.55), Connector (C93.2 R51.1)
DRXD: Core (U1.21), Peripheral (U9.25)
DTXD: Core (U1.22), Peripheral (U9.24)
EMDC: Core (U1.205), Network (R16.1 U5.31)
EMDINTR: Core (U1.2), Network (U5.7)
EMDIO: Core (U1.206), Network (R17.2 U5.30)
ERX0: Core (U1.195), Network (R12.3)
ERX1: Core (U1.196), Network (R12.4)
ERXDV: Core (U1.198), Network (R12.1)
ERXER: Core (U1.201), Network (R12.2)
ETX0: Core (U1.193), Network (R13#1.8)
ETX1: Core (U1.194), Network (R13#1.7)
ETXCK: Core (U1.202), Network (R69.1 R70.1)
ETXEN: Core (U1.197), Network (R13#1.5)
GP_SCL: Core (U1.164), Peripheral (R28.2 U7.2 U8.6)
GP_SDA: Core (U1.163), Peripheral (R29.2 U7.1 U8.5)
HD_N: Core (U1.50), Connector (R46.1)
HD_P: Core (U1.51), Connector (R47.1)
LED0: Core (U1.176), Peripheral (D1.2)
LED1: Core (U1.175), Peripheral (D2.2)
LED2: Core (U1.172), Peripheral (D3.2)
LED3: Core (U1.171), Peripheral (D4.2)
LED4: Core (U1.168), Peripheral (D5.2)
MCCDA: Core (U1.186), Connector (SD1.3)
MCCK: Core (U1.189), Connector (SD1.5)
MCDA0: Core (U1.185), Connector (SD1.7)
MCDA1: Core (U1.190), Connector (SD1.8)
MCDA2: Core (U1.191), Connector (SD1.1)
MCDA3: Core (U1.192), Connector (SD1.2)
NBS1: Core (R76.3), Memory (U3.39)
NBS3: Core (R76.2), Memory (U4.39)
NCE: Core (U1.59), Memory (R4.2 U2.9)
NRE: Core (U1.71), Memory (U2.8)
NRST: Core (R52.1 U1.36), Network (U5.29), Peripheral (C97.2 P17.1 U10.3), Connector (P5.15)
NTRST: Peripheral (U1.35), Connector (P5.3 R39.2)
NWE: Core (U1.72), Memory (U2.18)
PA26: Core (U1.3), Connector (P6.7)
PA27: Core (U1.4), Connector (P6.11)
PA28: Core (U1.7), Connector (P6.13)
PA29: Core (U1.8), Connector (P6.15)
RASN: Core (R80.2), Memory (U3.18 U4.18)
RNB: Core (U1.56), Memory (R3.2 U2.7)
RTCK: Peripheral (U1.37), Connector (P5.11)
RXD0: Core (U1.16), Connector (P6.10)
RXD1: Core (U1.18), Connector (P9.3)
RXD2: Core (U1.20), Connector (P10.3)
RXD3: Core (U1.162), Connector (P11.3)
SD_CD: Core (U1.184), Connector (R43.2 SD1.9)
SDA10: Core (R76.1), Memory (U3.22 U4.22)
SDCLK: Core (R77.8), Memory (U3.38 U4.38)
SDCLKE: Core (R77.6), Memory (U3.37 U4.37)
SDCS: Core (R1.2 R76.4), Memory (U3.19 U4.19)
SPI0_SCK: Core (U1.181), Peripheral (U10.2)
SPI0_SI: Core (U1.180), Peripheral (U10.1)
SPI0_SO: Core (U1.179), Peripheral (U10.8)
SPI1_MISO: Core (U1.9), Connector (P6.21)
SPI1_MOSI: Core (U1.10), Connector (P6.19)
SPI1_NCS0: Core (U1.12), Connector (P6.24)
SPI1_NCS1: Core (U1.67), Connector (P6.26)
SPI1_NCS2: Core (U1.62), Connector (P6.22)
SPI1_SCK: Core (U1.11), Connector (P6.23)
TCK: Peripheral (U1.34), Connector (P5.9 R42.2)
TDI: Peripheral (U1.30), Connector (P5.5 R40.2)
TDO: Peripheral (U1.29), Connector (P5.13)
TMS: Peripheral (U1.31), Connector (P5.7 R41.2)
TWCK: Core (U1.1), Connector (P6.5)
TWD: Core (U1.208), Connector (P6.3)
TXD0: Core (U1.15), Connector (P6.8)
TXD1: Core (U1.17), Connector (P9.2)
TXD2: Core (U1.19), Connector (P10.2)
TXD3: Core (U1.161), Connector (P11.2)
US_N: Peripheral (R33.2), Connector (P14.2)
US_P: Peripheral (R34.2), Connector (P14.3)
USB_PWR: Core (U1.23), Connector (R48.2 R49.1)
WEN: Core (R77.5), Memory (U3.16 U4.16)
WKUP: Core (U1.48), Peripheral (P16.1 R54.1)